# EAGLE design max486x (EAGLE 6.6.0)
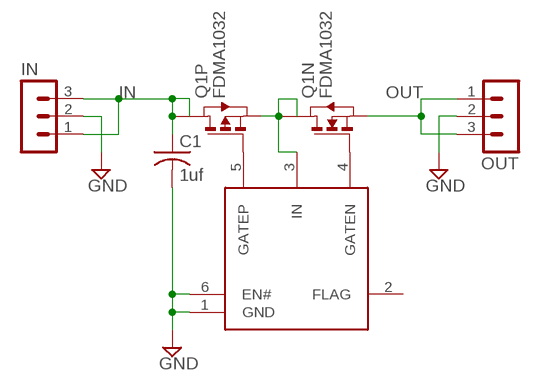
[diagram p0: schematic, sheet 1]

## Parts
C1  1uf  C-USC1206  [C1206]
IC1  MAX486X  [L622]
IN  MA03-1  [MA03-1]
OUT  MA03-1  [MA03-1]
Q1  FDMA1032  [MLP06]

## Nets
GND [power]: C1.2 IC1.1(GND) IC1.6(EN#) IN.2 OUT.2
IN [power]: C1.1 IN.1 IN.3 Q1.3(P:D1) Q1.3@1(P:D)
N$1 [power]: IC1.3(IN) Q1.4(P:S) Q1.6(N:D) Q1.6@1(N:D1)
N$2: IC1.5(GATEP) Q1.5(P:G)
N$3: IC1.4(GATEN) Q1.2(N:G)
OUT [power]: OUT.1 OUT.3 Q1.1(N:S)
Unconnected: IC1.2(FLAG)

## Library data of the parts
C1 = rcl:C-US: CAPACITOR, American symbol
IC1 = max486x:MAX486X: MAX486x Overvoltage Protection Controller
IN OUT = con-lstb:MA03-1: PIN HEADER; OC_FARNELL: unknown; OC_NEWARK: unknown
Q1 = max486x:FDMA1032: 20V Complementary MOSFET

## Net classes
1 power: width 0.508 mm

## Board
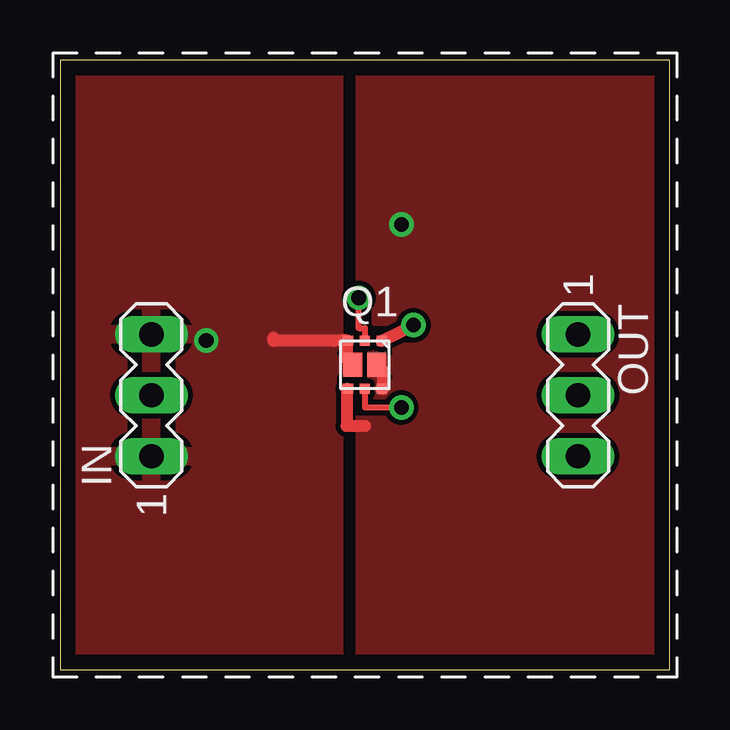
[diagram p1: board, top side]
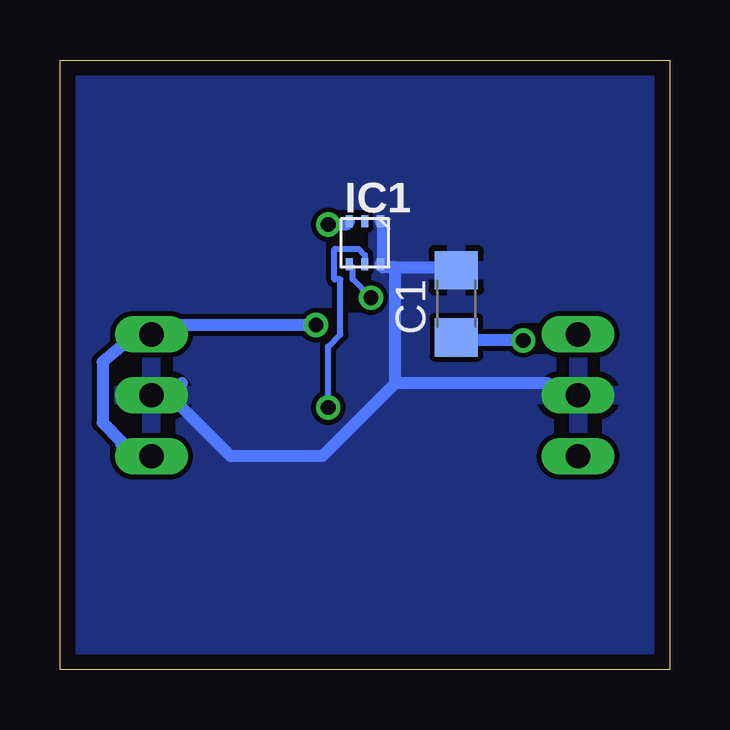
[diagram p2: board, bottom side, seen from below]

Size 25.4 x 25.4 mm. Coordinates in mm from the lower left corner, seen from the top.
Outline: 0,0 25.4,0 25.4,25.4 0,25.4 0,0
Copper layers (1*16): Top 0.035mm / dielectric 1.5mm / Bottom 0.035mm
Design rules "default *": minimum track width 10mil, minimum drill 24mil, track to track 8mil, track to pad 8mil, pad to pad 6mil, via to via 8mil, smd to smd 6mil, copper to edge 25mil, drill to drill 8mil, minimum pad ring 10mil, minimum via ring 8mil, stop-mask expansion 4mil, vias tented up to drill 0mil, thermal gap 10mil

### Footprints (pad centres in the part's own frame; a part is rotated, then mirrored left to right if it is on the bottom)
C1206 = smd 1.6 x 1.8: 1 -1.4,0; 2 1.4,0
L622 = smd 0.5 x 0.3: 1 -0.9,0.65; 2 -0.9,0; 3 -0.9,-0.65; 4 0.9,-0.65; 5 0.9,0; 6 0.9,0.65
MA03-1 = drill 1.016 long: 1 -2.54,0; 2 0,0; 3 2.54,0
MLP06 = smd 0.42 x 0.42: 1 -1,0.7; 2 -1,0; 3 -1,-0.7; 4 1,-0.7; 5 1,0; 6 1,0.7 | smd 1 x 0.8: 3@1 0,-0.5; 6@1 0,0.5

### Placement (x,y rotation side)
C1  8.89,15.24 90 bottom
IC1  12.7,17.78 270 bottom
IN  3.81,11.43 90 top
OUT  21.59,11.43 270 top
Q1  12.7,12.7 270 top

### Tracks (layer width: path | path; a pad name or v marks a point on that pad's centre or on a via)
GND
  Bottom 0.508: IC1.1 11.94,18.54 11.94,17.02 IC1.6 11.94,16.76 11.43,16.76 | 11.43,16.76 9.65,16.76 C1.2 | 11.43,11.94 11.43,16.76 | 11.43,11.94 5.08,11.94 IN.2 | 20.32,11.94 OUT.2 20.32,10.92 18.29,8.89 14.48,8.89 11.43,11.94
  pour Bottom: 0,0 25.4,0 25.4,25.4 0,25.4
IN  (via drill 0.61)
  Top 0.508: Q1.3 11.94,13.72 11.68,13.72 11.4,13.7 8.89,13.7 C1.1 | Q1.3 | Q1.3 11.94,13.46 11.94,12.95 Q1.3@1
  Bottom 0.508: v6.1,13.72 8.13,13.72 C1.1
  pour Top: 0,0 11.43,0 11.43,25.4 0,25.4
N$1  (via drill 0.61)
  Top 0.508: Q1.4 11.94,11.68 11.94,10.16 12.45,10.16 12.7,10.16 | Q1.6 13.46,11.68 13.46,12.45 Q1.6@1
  Bottom 0.508: v14.22,18.54 13.46,18.54 IC1.3
  pour Top: 12.7,25.4 25.4,25.4 25.4,0 12.7,0
N$2  (via drill 0.61)
  Top 0.254: v14.22,10.92 12.7,10.92 12.7,11.68 Q1.5
  Bottom 0.254: v14.22,10.92 14.22,13.46 13.72,13.97 13.72,16.26 13.97,16.26 13.97,17.53 12.95,17.53 12.7,17.27 12.7,17.02 IC1.5
N$3  (via drill 0.61)
  Top 0.254: v12.45,15.49 12.45,14.22 12.7,14.22 12.7,13.72 Q1.2
  Bottom 0.254: v12.45,15.49 13.21,16.26 13.21,16.76 IC1.4
OUT  (via drill 0.61)
  Top 0.508: Q1.1 v14.73,14.35
  Bottom 0.508: OUT.3 22.86,9.4 22.86,9.53 23.62,10.29 23.62,12.83 22.86,13.46 OUT.1 20.32,14.35 v14.73,14.35